# EAGLE schematic schema (EAGLE 9.5.0)
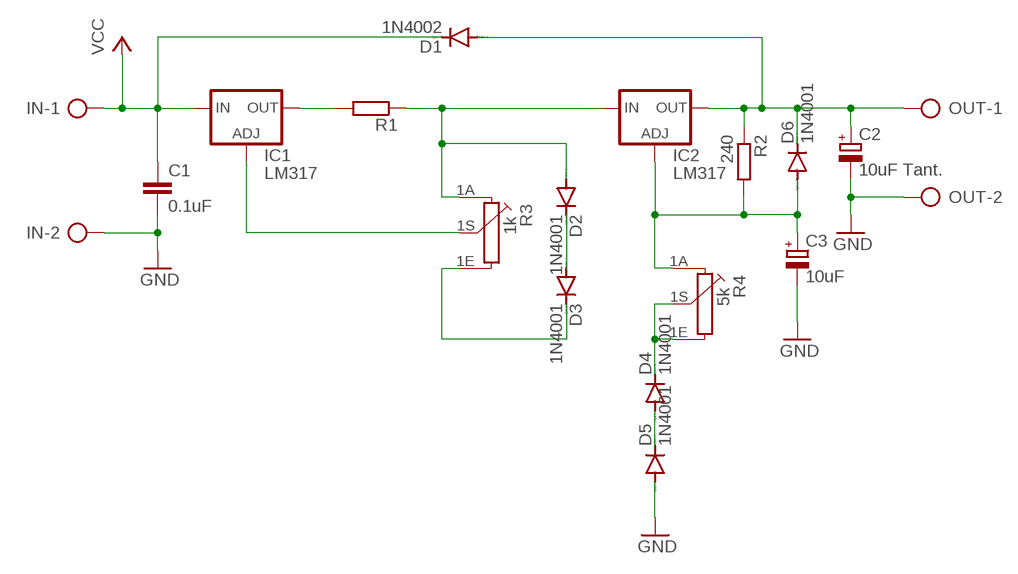
[diagram p0: schematic, sheet 1]

## Parts
C1  0.1uF  C-EU025-024X044  [C025-024X044]
C2  10uF Tant.  CPOL-EUE2-5  [E2-5]
C3  10uF  CPOL-EUE2-5  [E2-5]
D1  1N4002  1N4004  [DO41-10]
D2  1N4001  1N4004  [DO41-10]
D3  1N4001  1N4004  [DO41-10]
D4  1N4001  1N4004  [DO41-10]
D5  1N4001  1N4004  [DO41-10]
D6  1N4001  1N4004  [DO41-10]
IC1  LM317  LM317TS  [317TS]
IC2  LM317  LM317TS  [317TS]
IN  SMKDSP_1,5/2  [SMKDSP_1,5/2]
OUT  SMKDSP_1,5/2  [SMKDSP_1,5/2]
R1  R-EU_0204/7  [0204/7]
R2  240  R-EU_0204/7  [0204/7]
R3  1k  PC16S  [PC16S]
R4  5k  PC16S  [PC16S]

## Nets
GND: C1.2 C2.- C3.- D5.A IN.2 OUT.2
N$1: C2.+ D1.A D6.C IC2.2(OUT) OUT.1 R2.1
N$2: IC1.2(OUT) R1.2
N$3: D2.A IC2.3(IN) R1.1 R3.1A
N$4: D2.C D3.A
N$5: IC1.1(ADJ) R3.1S
N$6: D4.A D5.C
N$7: D3.C R3.1E
N$9: C3.+ D6.A IC2.1(ADJ) R2.2 R4.1A
N$10: D4.C R4.1E R4.1S
VCC: C1.1 D1.C IC1.3(IN) IN.1

## Library data of the parts
C1 = rcl:C-EU: CAPACITOR, European symbol; SPICEPREFIX: C
C2 C3 = rcl:CPOL-EU: POLARIZED CAPACITOR, European symbol; SPICEPREFIX: C
D1-D6 = diode:1N4004: DIODE general purpose rectifier, 1 A
IC1 IC2 = v-reg:LM317TS: VOLTAGE REGULATOR
IN OUT = con-phoenix-smkdsp:SMKDSP_1,5/2: Printklemme, Nennstrom: 17,5 A, Bemessungsspannung: 250 V, Raster: 5,0 mm Source: http://eshop.phoenixcontact.de .. 1733415.pdf; MF: FARNELL; MPN: 1733570; OC_FARNELL: 3041244; OC_NEWARK: 69C8588
R1 R2 = rcl:R-EU_: RESISTOR, European symbol; SPICEPREFIX: R
R3 R4 = piher:PC16S: POTENTIOMETER single carbon potentiometer, 16 mm, S3ROH; OC_FARNELL: 4452940; OC_NEWARK: unknown